# EAGLE schematic cbm2-8088 (EAGLE 5.11)
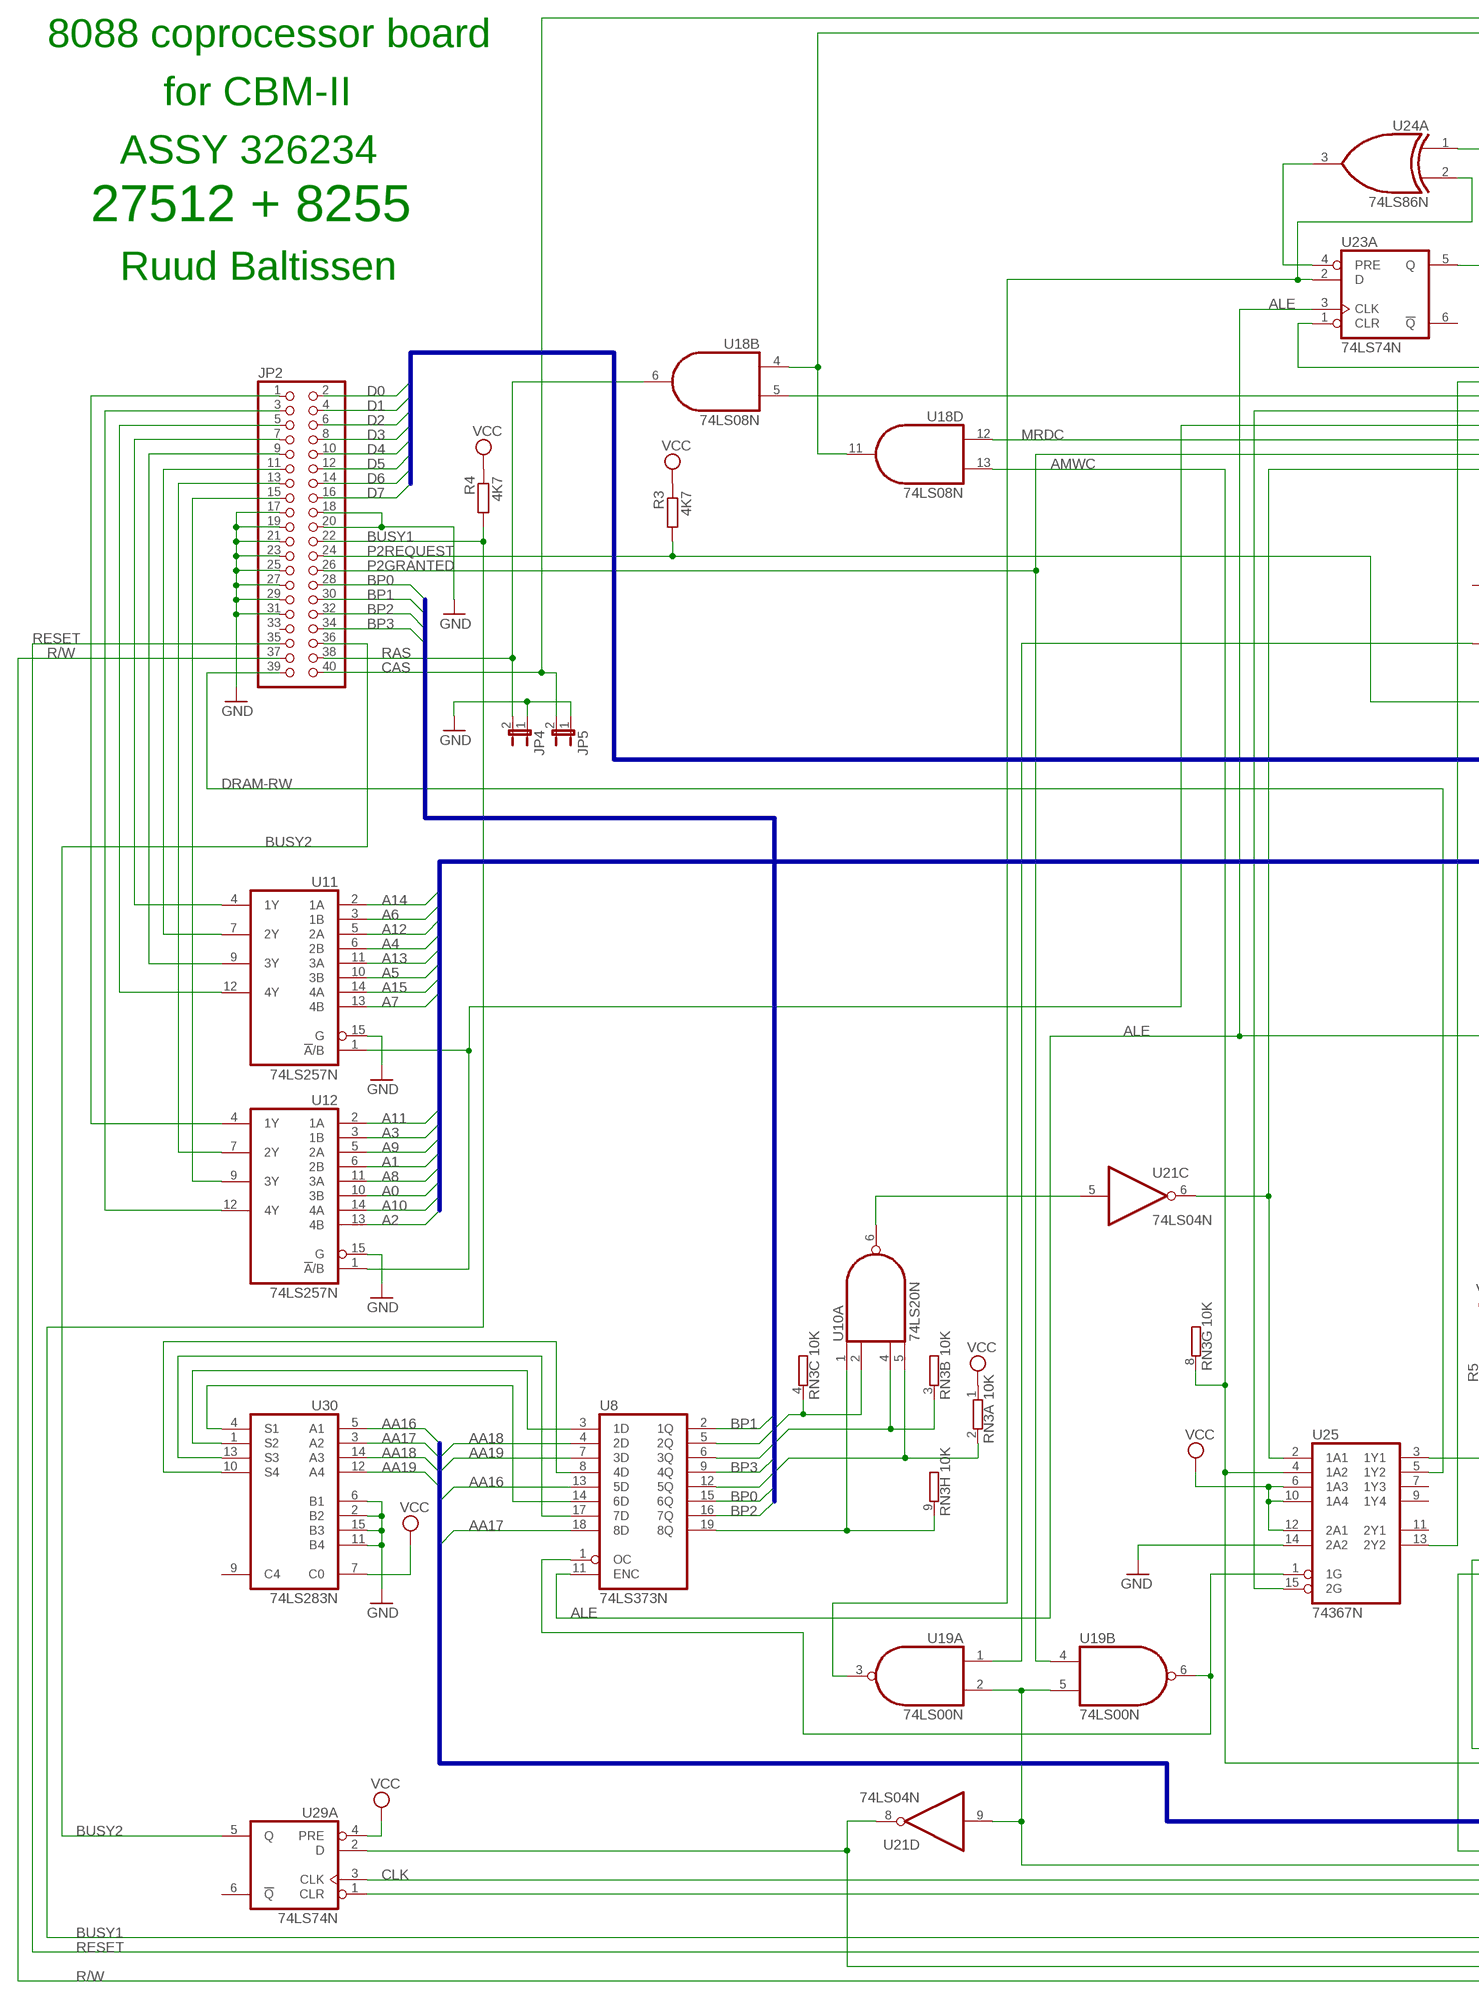
[diagram p0: schematic, sheet 1, part 1 of 2]
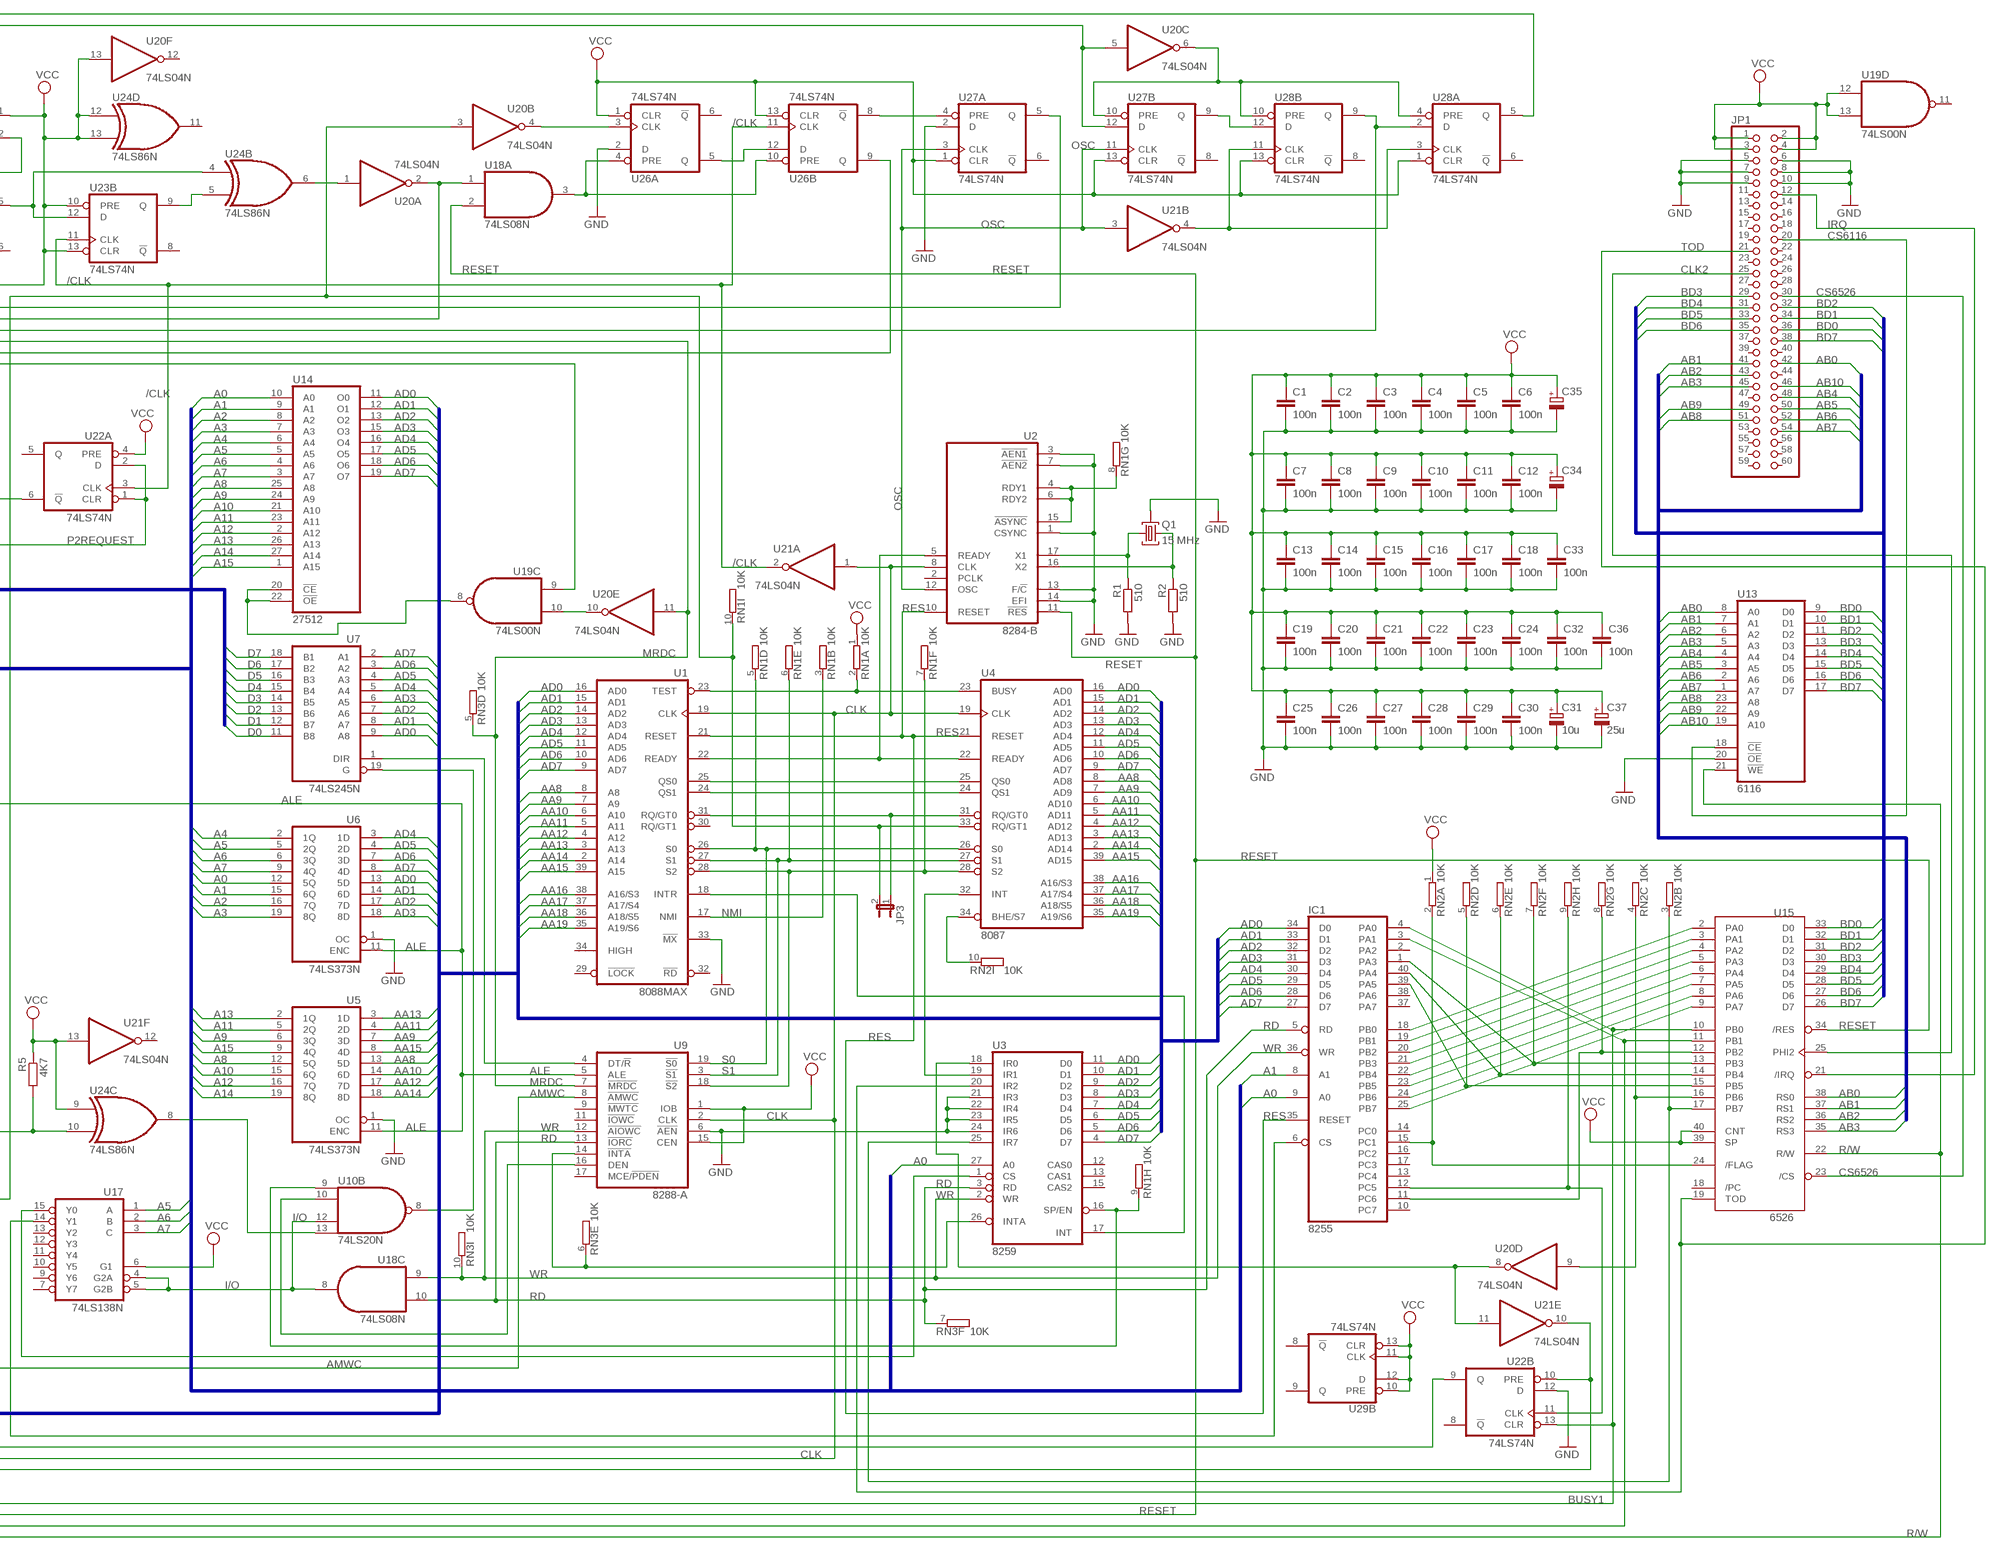
[diagram p1: schematic, sheet 1, part 2 of 2]

## Parts
C1  100n  C-EU075-032X103  [C075-032X103]
C2  100n  C-EU075-032X103  [C075-032X103]
C3  100n  C-EU075-032X103  [C075-032X103]
C4  100n  C-EU075-032X103  [C075-032X103]
C5  100n  C-EU075-032X103  [C075-032X103]
C6  100n  C-EU075-032X103  [C075-032X103]
C7  100n  C-EU075-032X103  [C075-032X103]
C8  100n  C-EU075-032X103  [C075-032X103]
C9  100n  C-EU075-032X103  [C075-032X103]
C10  100n  C-EU075-032X103  [C075-032X103]
C11  100n  C-EU075-032X103  [C075-032X103]
C12  100n  C-EU075-032X103  [C075-032X103]
C13  100n  C-EU075-032X103  [C075-032X103]
C14  100n  C-EU075-032X103  [C075-032X103]
C15  100n  C-EU075-032X103  [C075-032X103]
C16  100n  C-EU075-032X103  [C075-032X103]
C17  100n  C-EU075-032X103  [C075-032X103]
C18  100n  C-EU075-032X103  [C075-032X103]
C19  100n  C-EU075-032X103  [C075-032X103]
C20  100n  C-EU075-032X103  [C075-032X103]
C21  100n  C-EU075-032X103  [C075-032X103]
C22  100n  C-EU075-032X103  [C075-032X103]
C23  100n  C-EU075-032X103  [C075-032X103]
C24  100n  C-EU075-032X103  [C075-032X103]
C25  100n  C-EU075-032X103  [C075-032X103]
C26  100n  C-EU075-032X103  [C075-032X103]
C27  100n  C-EU075-032X103  [C075-032X103]
C28  100n  C-EU075-032X103  [C075-032X103]
C29  100n  C-EU075-032X103  [C075-032X103]
C30  100n  C-EU075-032X103  [C075-032X103]
C31  10u  CPOL-EUE3.5-10  [E3,5-10]
C32  100n  C-EU075-032X103  [C075-032X103]
C33  100n  C-EU075-032X103  [C075-032X103]
C34  CPOL-EUE2.5-5  [E2,5-5]
C35  CPOL-EUE2.5-5  [E2,5-5]
C36  100n  C-EU075-032X103  [C075-032X103]
C37  25u  CPOL-EUE5-6  [E5-6]
IC1  8255  8255A  [DIL40]
JP1  PINHD-2X30  [2X30]
JP2  PINHD-2X20  [2X20]
JP3  JP1E  [JP1]
JP4  JP1E  [JP1]
JP5  JP1E  [JP1]
Q1  15 MHz  HC49TL-H  [HC49TL-H]
R1  510  R-EU_0204/2V  [0204V]
R2  510  R-EU_0204/2V  [0204V]
R3  4K7  R-EU_0204/2V  [0204V]
R4  4K7  R-EU_0204/7  [0204/7]
R5  4K7  R-EU_0204/2V  [0204V]
RN1  10K  GE09R  [SIL10]
RN2  10K  GE09R  [SIL10]
RN3  10K  GE09R  [SIL10]
U1  8088MAX  [DIL40]
U2  8284-B  [DIL18]
U3  8259  8259A  [DIL28-6]
U4  8087  [DIL40]
U5  74LS373N  [DIL20]
U6  74LS373N  [DIL20]
U7  74LS245N  [DIL20]
U8  74LS373N  [DIL20]
U9  8288-A  [DIL20]
U10  74LS20N  [DIL14]
U11  74LS257N  [DIL16]
U12  74LS257N  [DIL16]
U13  6116  [DIL24]
U14  27512  [DIL28]
U15  6526  [DIP40]
U17  74LS138N  [DIL16]
U18  74LS08N  [DIL14]
U19  74LS00N  [DIL14]
U20  74LS04N  [DIL14]
U21  74LS04N  [DIL14]
U22  74LS74N  [DIL14]
U23  74LS74N  [DIL14]
U24  74LS86N  [DIL14]
U25  74367N  [DIL16]
U26  74LS74N  [DIL14]
U27  74LS74N  [DIL14]
U28  74LS74N  [DIL14]
U29  74LS74N  [DIL14]
U30  74LS283N  [DIL16]

## Nets
/CLK: U21.2(A:O) U22.3(A:CLK) U23.11(B:CLK) U26.11(B:CLK)
A0: IC1.9(A0) U3.27(A0) U6.12(5Q) U12.10(3B) U14.10(A0)
A1: IC1.8(A1) U6.15(6Q) U12.6(2B) U14.9(A1)
A2: U6.16(7Q) U12.13(4B) U14.8(A2)
A3: U6.19(8Q) U12.3(1B) U14.7(A3)
A4: U6.2(1Q) U11.6(2B) U14.6(A4)
A5: U6.5(2Q) U11.10(3B) U14.5(A5) U17.1(A)
A6: U6.6(3Q) U11.3(1B) U14.4(A6) U17.2(B)
A7: U6.9(4Q) U11.13(4B) U14.3(A7) U17.3(C)
A8: U5.12(5Q) U12.11(3A) U14.25(A8)
A9: U5.6(3Q) U12.5(2A) U14.24(A9)
A10: U5.15(6Q) U12.14(4A) U14.21(A10)
A11: U5.5(2Q) U12.2(1A) U14.23(A11)
A12: U5.16(7Q) U11.5(2A) U14.2(A12)
A13: U5.2(1Q) U11.11(3A) U14.26(A13)
A14: U5.19(8Q) U11.2(1A) U14.27(A14)
A15: U5.9(4Q) U11.14(4A) U14.1(A15)
AA8: U1.8(A8) U4.8(AD8) U5.13(5D)
AA9: U1.7(A9) U4.7(AD9) U5.7(3D)
AA10: U1.6(A10) U4.6(AD10) U5.14(6D)
AA11: U1.5(A11) U4.5(AD11) U5.4(2D)
AA12: U1.4(A12) U4.4(AD12) U5.17(7D)
AA13: U1.3(A13) U4.3(AD13) U5.3(1D)
AA14: U1.2(A14) U4.2(AD14) U5.18(8D)
AA15: U1.39(A15) U4.39(AD15) U5.8(4D)
AA16: U1.38(A16/S3) U4.38(A16/S3) U8.13(5D) U30.5(A1)
AA17: U1.37(A17/S4) U4.37(A17/S4) U8.18(8D) U30.3(A2)
AA18: U1.36(A18/S5) U4.36(A18/S5) U8.4(2D) U30.14(A3)
AA19: U1.35(A19/S6) U4.35(A19/S6) U8.7(3D) U30.12(A4)
AB0: JP1.42 U13.8(A0) U15.38(RS0)
AB1: JP1.41 U13.7(A1) U15.37(RS1)
AB2: JP1.43 U13.6(A2) U15.36(RS2)
AB3: JP1.45 U13.5(A3) U15.35(RS3)
AB4: JP1.48 U13.4(A4)
AB5: JP1.50 U13.3(A5)
AB6: JP1.52 U13.2(A6)
AB7: JP1.54 U13.1(A7)
AB8: JP1.51 U13.23(A8)
AB9: JP1.49 U13.22(A9)
AB10: JP1.46 U13.19(A10)
AD0: IC1.34(D0) U1.16(AD0) U3.11(D0) U4.16(AD0) U6.13(5D) U7.9(A8) U14.11(O0)
AD1: IC1.33(D1) U1.15(AD1) U3.10(D1) U4.15(AD1) U6.14(6D) U7.8(A7) U14.12(O1)
AD2: IC1.32(D2) U1.14(AD2) U3.9(D2) U4.14(AD2) U6.17(7D) U7.7(A6) U14.13(O2)
AD3: IC1.31(D3) U1.13(AD3) U3.8(D3) U4.13(AD3) U6.18(8D) U7.6(A5) U14.15(O3)
AD4: IC1.30(D4) U1.12(AD4) U3.7(D4) U4.12(AD4) U6.3(1D) U7.5(A4) U14.16(O4)
AD5: IC1.29(D5) U1.11(AD5) U3.6(D5) U4.11(AD5) U6.4(2D) U7.4(A3) U14.17(O5)
AD6: IC1.28(D6) U1.10(AD6) U3.5(D6) U4.10(AD6) U6.7(3D) U7.3(A2) U14.18(O6)
AD7: IC1.27(D7) U1.9(AD7) U3.4(D7) U4.9(AD7) U6.8(4D) U7.2(A1) U14.19(O7)
ALE: U5.11(ENC) U6.11(ENC) U8.11(ENC) U9.5(ALE) U23.3(A:CLK)
AMWC: RN3.8 U9.8(!AMWC) U18.13(D:I1) U25.4(1A2)
BD0: JP1.36 U13.9(D0) U15.33(D0)
BD1: JP1.34 U13.10(D1) U15.32(D1)
BD2: JP1.32 U13.11(D2) U15.31(D2)
BD3: JP1.29 U13.13(D3) U15.30(D3)
BD4: JP1.31 U13.14(D4) U15.29(D4)
BD5: JP1.33 U13.15(D5) U15.28(D5)
BD6: JP1.35 U13.16(D6) U15.27(D6)
BD7: JP1.38 U13.17(D7) U15.26(D7)
BP0: JP2.28 U8.15(6Q)
BP1: JP2.30 U8.2(1Q)
BP2: JP2.32 U8.16(7Q)
BP3: JP2.34 U8.9(4Q)
BUSY1: IC1.4(PA0) JP2.22 R4.2 U15.10(PB0) U22.13(B:CLR)
BUSY2: JP2.36 U29.5(A:Q)
CAS: JP2.40 JP5.2 U28.5(A:Q)
CLK: U1.19(CLK) U2.8(CLK) U4.19(CLK) U9.2(CLK) U21.1(A:I) U29.3(A:CLK)
CLK2: JP1.25 U15.25(PHI2)
CS6116: JP1.20 U13.18(!CE)
CS6526: JP1.30 U15.23(/CS)
D0: JP2.2 U7.11(B8)
D1: JP2.4 U7.12(B7)
D2: JP2.6 U7.13(B6)
D3: JP2.8 U7.14(B5)
D4: JP2.10 U7.15(B4)
D5: JP2.12 U7.16(B3)
D6: JP2.14 U7.17(B2)
D7: JP2.16 U7.18(B1)
DRAM-RW: JP2.39 U25.5(1Y2)
GND: C1.2 C2.2 C3.2 C4.2 C5.2 C6.2 C7.2 C8.2 C9.2 C10.2 C11.2 C12.2 C13.2 C14.2 C15.2 C16.2 C17.2 C18.2 C19.2 C20.2 C21.2 C22.2 C23.2 C24.2 C25.2 C26.2 C27.2 C28.2 C29.2 C30.2 C31.- C32.2 C33.2 C34.- C35.- C36.2 C37.- JP1.5 JP1.6 JP1.7 JP1.8 JP1.9 JP1.10 JP2.17 JP2.18 JP2.19 JP2.20 JP2.21 JP2.23 JP2.25 JP2.27 JP2.29 JP2.31 JP4.1 JP5.1 Q1.3 R1.2 R2.2 U1.33(!MX) U2.1(CSYNC) U2.3(!AEN1) U2.7(!AEN2) U2.13(F/!C) U2.14(EFI) U3.21(IR3) U3.22(IR4) U3.23(IR5) U3.24(IR6) U5.1(OC) U6.1(OC) U9.6(!AEN) U11.15(G) U12.15(G) U13.20(!OE) U22.12(B:D) U25.14(2A2) U26.2(A:D) U27.2(A:D) U30.2(B2) U30.6(B1) U30.11(B4) U30.15(B3)
I/O: U10.12(B:I2) U17.4(G2A) U17.5(G2B) U18.8(C:O)
IRQ: JP1.12 U15.21(/IRQ)
MRDC: RN3.5 U9.7(!MRDC) U18.12(D:I0) U20.11(E:I)
N$1: RN1.2 U1.23(TEST) U4.23(BUSY)
N$2: U14.20(!CE) U14.22(!OE) U19.8(C:O)
N$3: RN2.10 U4.34(BHE/S7)
N$4: U1.22(READY) U2.5(READY) U4.22(READY)
N$5: U1.25(QS0) U4.25(QS0)
N$6: U1.24(QS1) U4.24(QS1)
N$7: JP3.2 RN1.10 U4.33(RQ/GT1) U20.3(B:I) U25.13(2Y2)
N$8: Q1.1 R1.1 U2.17(X1)
N$9: U7.19(G) U10.8(B:O)
N$10: JP3.1 U1.31(RQ/GT0) U4.31(RQ/GT0)
N$11: RN1.7 U1.28(S2) U4.28(S2) U9.18(!S2)
N$12: RN1.9 U3.16(SP/EN) U10.9(B:I0)
N$13: RN1.8 U2.4(RDY1) U2.6(RDY2) U2.15(!ASYNC)
N$14: Q1.2 R2.1 U2.16(X2)
N$15: U9.16(DEN) U10.10(B:I1)
N$16: U3.18(IR0) U20.8(D:O) U21.11(E:I)
N$17: IC1.6(CS) U17.14(Y1)
N$18: IC1.18(PB0) U15.2(PA0)
N$19: U19.10(C:I1) U20.10(E:O)
N$20: RN3.6 U3.26(INTA) U9.14(!INTA)
N$21: U3.19(IR1) U4.32(INT)
N$22: U3.1(CS) U17.15(Y0)
N$23: U7.1(DIR) U9.4(DT/!R)
N$24: U20.6(C:O) U27.10(B:PRE) U28.4(A:PRE) U28.10(B:PRE)
N$25: U8.1(OC) U19.6(B:O) U25.1(1G)
N$26: R5.2 U24.10(C:I1) U25.3(1Y1)
N$27: U10.13(B:I3) U24.8(C:O)
N$28: U19.9(C:I0) U21.6(C:O) U25.2(1A1)
N$29: IC1.15(PC1) RN2.2 U15.24(/FLAG)
N$30: RN2.4 U15.16(PB6) U20.9(D:I)
N$31: IC1.19(PB1) U15.3(PA1)
N$32: IC1.20(PB2) U15.4(PA2)
N$33: IC1.21(PB3) U15.5(PA3)
N$34: IC1.22(PB4) U15.6(PA4)
N$35: IC1.23(PB5) U15.7(PA5)
N$36: IC1.24(PB6) U15.8(PA6)
N$37: IC1.25(PB7) U15.9(PA7)
N$39: RN2.3 U3.25(IR7) U15.17(PB7)
N$40: U19.2(A:I1) U19.5(B:I1) U21.9(D:I) U22.9(B:Q)
N$41: IC1.39(PA5) RN2.5 U15.15(PB5)
N$42: IC1.40(PA4) RN2.6 U15.14(PB4)
N$43: IC1.1(PA3) RN2.7 U15.13(PB3)
N$44: IC1.11(PC6) RN2.8 U15.12(PB2)
N$45: IC1.3(PA1) U15.11(PB1) U21.8(D:O) U29.2(A:D)
N$52: U23.5(A:Q) U23.12(B:D) U24.4(B:I0)
N$53: U19.3(A:O) U23.2(A:D) U24.2(A:I1)
N$54: U23.4(A:PRE) U24.3(A:O)
N$55: U20.1(A:I) U24.6(B:O)
N$56: U23.9(B:Q) U24.5(B:I1)
N$57: U18.1(A:I0) U20.2(A:O) U25.15(2G)
N$58: U8.14(6D) U30.4(S1)
N$59: U8.3(1D) U30.1(S2)
N$60: U18.5(B:I1) U27.5(A:Q)
N$61: U18.4(B:I0) U18.11(D:O) U20.5(C:I) U27.12(B:D)
N$63: U8.17(7D) U30.13(S3)
N$64: U21.4(B:O) U28.3(A:CLK) U28.11(B:CLK)
N$65: U27.9(B:Q) U28.12(B:D)
N$66: U11.1(!A!/B) U12.1(!A!/B) U28.2(A:D) U28.9(B:Q)
N$68: U8.8(4D) U30.10(S4)
N$69: RN3.4 U8.5(2Q) U10.2(A:I1)
N$70: RN3.3 U8.6(3Q) U10.4(A:I2)
N$71: RN3.2 U8.12(5Q) U10.5(A:I3)
N$72: RN3.9 U8.19(8Q) U10.1(A:I0)
N$73: U10.6(A:O) U21.5(C:I)
N$78: U21.10(E:O) U22.10(B:PRE) U29.1(A:CLR)
N$79: IC1.12(PC5) RN2.9 U22.11(B:CLK)
N$82: U26.8(B:!Q) U27.4(A:PRE)
N$85: U26.5(A:Q) U26.12(B:D)
N$86: U18.3(A:O) U26.4(A:PRE) U26.10(B:PRE)
N$87: U20.4(B:O) U26.3(A:CLK)
N$88: U19.1(A:I0) U22.6(A:!Q)
N$95: JP2.1 U12.4(1Y)
N$96: JP2.3 U12.12(4Y)
N$97: JP2.5 U11.12(4Y)
N$98: JP2.7 U11.4(1Y)
N$99: JP2.9 U11.9(3Y)
N$100: JP2.11 U11.7(2Y)
N$101: JP2.13 U12.7(2Y)
N$102: JP2.15 U12.9(3Y)
N$165: U1.18(INTR) U3.17(INT)
NMI: RN1.3 U1.17(NMI)
OSC: U2.12(OSC) U21.3(B:I) U27.3(A:CLK) U27.11(B:CLK)
P2GRANTED: JP2.26 U19.4(B:I0) U26.9(B:Q)
P2REQUEST: JP2.24 R3.2 U22.1(A:CLR) U22.2(A:D)
R/W: JP2.37 U13.21(!WE) U15.22(R/W)
RAS: JP2.38 JP4.2 U18.6(B:O)
RD: IC1.5(RD) RN3.7 U3.3(RD) U9.13(!IORC) U18.10(C:I1)
RES: IC1.35(RESET) U1.21(RESET) U2.10(RESET) U4.21(RESET)
RESET: JP2.35 U2.11(!RES) U15.34(/RES) U18.2(A:I1)
S0: RN1.5 U1.26(S0) U4.26(S0) U9.19(!S0)
S1: RN1.6 U1.27(S1) U4.27(S1) U9.3(!S1)
TOD: JP1.21 U3.20(IR2) U15.19(TOD)
VCC: C1.1 C2.1 C3.1 C4.1 C5.1 C6.1 C7.1 C8.1 C9.1 C10.1 C11.1 C12.1 C13.1 C14.1 C15.1 C16.1 C17.1 C18.1 C19.1 C20.1 C21.1 C22.1 C23.1 C24.1 C25.1 C26.1 C27.1 C28.1 C29.1 C30.1 C31.+ C32.1 C33.1 C34.+ C35.+ C36.1 C37.+ JP1.1 JP1.2 JP1.3 JP1.4 R3.1 R4.1 R5.1 RN1.1 RN2.1 RN3.1 U9.1(IOB) U9.15(CEN) U15.39(SP) U15.40(CNT) U17.6(G1) U19.12(D:I0) U19.13(D:I1) U20.13(F:I) U21.13(F:I) U22.4(A:PRE) U23.1(A:CLR) U23.10(B:PRE) U23.13(B:CLR) U24.1(A:I0) U24.9(C:I0) U24.12(D:I0) U24.13(D:I1) U25.6(1A3) U25.10(1A4) U25.12(2A1) U26.1(A:CLR) U26.13(B:CLR) U27.1(A:CLR) U27.13(B:CLR) U28.1(A:CLR) U28.13(B:CLR) U29.4(A:PRE) U29.10(B:PRE) U29.11(B:CLK) U29.12(B:D) U29.13(B:CLR) U30.7(C0)
WR: IC1.36(WR) RN3.10 U3.2(WR) U9.12(!AIOWC) U18.9(C:I0)
Unconnected: IC1.2(PA2) IC1.10(PC7) IC1.13(PC4) IC1.14(PC0) IC1.16(PC2) IC1.17(PC3) IC1.37(PA7) IC1.38(PA6) JP1.11 JP1.13 JP1.14 JP1.15 JP1.16 JP1.17 JP1.18 JP1.19 JP1.22 JP1.23 JP1.24 JP1.26 JP1.27 JP1.28 JP1.37 JP1.39 JP1.40 JP1.44 JP1.47 JP1.53 JP1.55 JP1.56 JP1.57 JP1.58 JP1.59 JP1.60 JP2.33 RN1.4 U1.29(!LOCK) U1.30(RQ/GT1) U1.32(!RD) U1.34(HIGH) U2.2(PCLK) U3.12(CAS0) U3.13(CAS1) U3.15(CAS2) U9.9(!MWTC) U9.11(!IOWC) U9.17(MCE/!PDEN) U15.18(/PC) U17.7(Y7) U17.9(Y6) U17.10(Y5) U17.11(Y4) U17.12(Y3) U17.13(Y2) U19.11(D:O) U20.12(F:O) U21.12(F:O) U22.5(A:Q) U22.8(B:!Q) U23.6(A:!Q) U23.8(B:!Q) U24.11(D:O) U25.7(1Y3) U25.9(1Y4) U25.11(2Y1) U26.6(A:!Q) U27.6(A:!Q) U27.8(B:!Q) U28.6(A:!Q) U28.8(B:!Q) U29.6(A:!Q) U29.8(B:!Q) U29.9(B:Q) U30.9(C4)

## Buses
ADDRESS:AD[0..7],AA[8..19]
ADDRESSBUS:A[0..19]
DATABUS:D[0..7]
BP:BP[0..3]
ADDRESSB:AB[0..15]
BD:BD[0..7]

## Notes on the sheet
- 8088 coprocessor board
- for CBM-II
- ASSY 326234
- 27512 + 8255
- Ruud Baltissen

## Power pins joined to a net without a drawn wire
GND: IC1.7(GND) U1.1(GND) U1.20(GND) U2.9(GND) U3.14(GND) U4.1(GND) U4.20(GND) U5.10(GND) U6.10(GND) U7.10(GND) U8.10(GND) U9.10(GND) U10.7(P:GND) U11.8(GND) U12.8(GND) U13.12(GND) U14.14(GND) U15.1(GND) U17.8(GND) U18.7(P:GND) U19.7(P:GND) U20.7(P:GND) U21.7(P:GND) U22.7(P:GND) U23.7(P:GND) U24.7(P:GND) U25.8(GND) U26.7(P:GND) U27.7(P:GND) U28.7(P:GND) U29.7(P:GND) U30.8(GND)
VCC: IC1.26(VCC) U1.40(VCC) U2.18(VCC) U3.28(VCC) U4.40(VCC) U5.20(VCC) U6.20(VCC) U7.20(VCC) U8.20(VCC) U9.20(VCC) U10.14(P:VCC) U11.16(VCC) U12.16(VCC) U13.24(VCC) U14.28(VCC) U15.20(VCC) U17.16(VCC) U18.14(P:VCC) U19.14(P:VCC) U20.14(P:VCC) U21.14(P:VCC) U22.14(P:VCC) U23.14(P:VCC) U24.14(P:VCC) U25.16(VCC) U26.14(P:VCC) U27.14(P:VCC) U28.14(P:VCC) U29.14(P:VCC) U30.16(VCC)

## Library data of the parts
C1-C30 C32 C33 C36 = rcl:C-EU: CAPACITOR, European symbol
C31 C34 C35 C37 = rcl:CPOL-EU: POLARIZED CAPACITOR, European symbol
IC1 = micro-intel:8255A: MICROCOMPUTER/PERIPHERAL DEVICE; OC_FARNELL: unknown; OC_NEWARK: unknown
JP1 = pinhead:PINHD-2X30: PIN HEADER
JP2 = pinhead:PINHD-2X20: PIN HEADER
JP3-JP5 = jumper:JP1E: JUMPER
Q1 = crystal:HC49TL-H: CRYSTAL; OC_FARNELL: unknown; OC_NEWARK: unknown
R1-R3 R5 = rcl:R-EU_: RESISTOR, European symbol
R4 = resistor:R-EU_: RESISTOR, European symbol
RN1-RN3 = resistor-sil:GE09R: SIL RESISTOR
U1 = 0Ruud:8088MAX: MICROCOMPUTER/PERIPHERAL DEVICE
U2 = micro-siemens:8284-B: MICROPROCESSOR/PERIPHERAL DEVICE
U3 = micro-intel:8259A: MICROCOMPUTER/PERIPHERAL DEVICE; OC_FARNELL: unknown; OC_NEWARK: unknown
U4 = 0Ruud:8087: MICROCOMPUTER/PERIPHERAL DEVICE
U5 U6 U8 = 74xx-us:74*373: Octal D type transparent LATCH, edge triggered
U7 = 74xx-us:74*245: Octal BUS TRANSCEIVER, 3-state
U9 = micro-siemens:8288-A: MICROPROCESSOR/PERIPHERAL DEVICE
U10 = 74xx-us:74*20: Dual 4-input NAND gate
U11 U12 = 74xx-us:74*257: Quadruple 2-to 1 line data SELECTOR/MULTIPLEXER
U13 = 0RB_Memory:6116: 2K*8 SRAM
U14 = memory:27512: MEMORY
U15 = 0RB_65xx:6526: I/O device: two 8-bits ports, handshake lines, timers. Used in C64 and C128.
U17 = 0RB_TTL:74*138: 3-line to 8-line DECODER/DEMULTIPLEXER smaller then original version
U18 = 74xx-us:74*08: Quad 2-input AND gate
U19 = 74xx-us:74*00: Quad 2-input NAND gate
U20 U21 = 74xx-us:74*04: Hex INVERTER
U22 U23 U26-U29 = 74xx-us:74*74: Dual D type positive edge triggered FLIP FLOP, preset and clear
U24 = 74xx-us:74*86: Quad 2-input EXCLUSIV-OR (XOR) gate
U25 = 74xx-us:74*367: Hex BUS DRIVER, 3-state
U30 = 74xx-us:74*283: 4-bit binary FULL ADDER, fast carry